# EAGLE design matts pcb schematic v3 (EAGLE 9.6.2)
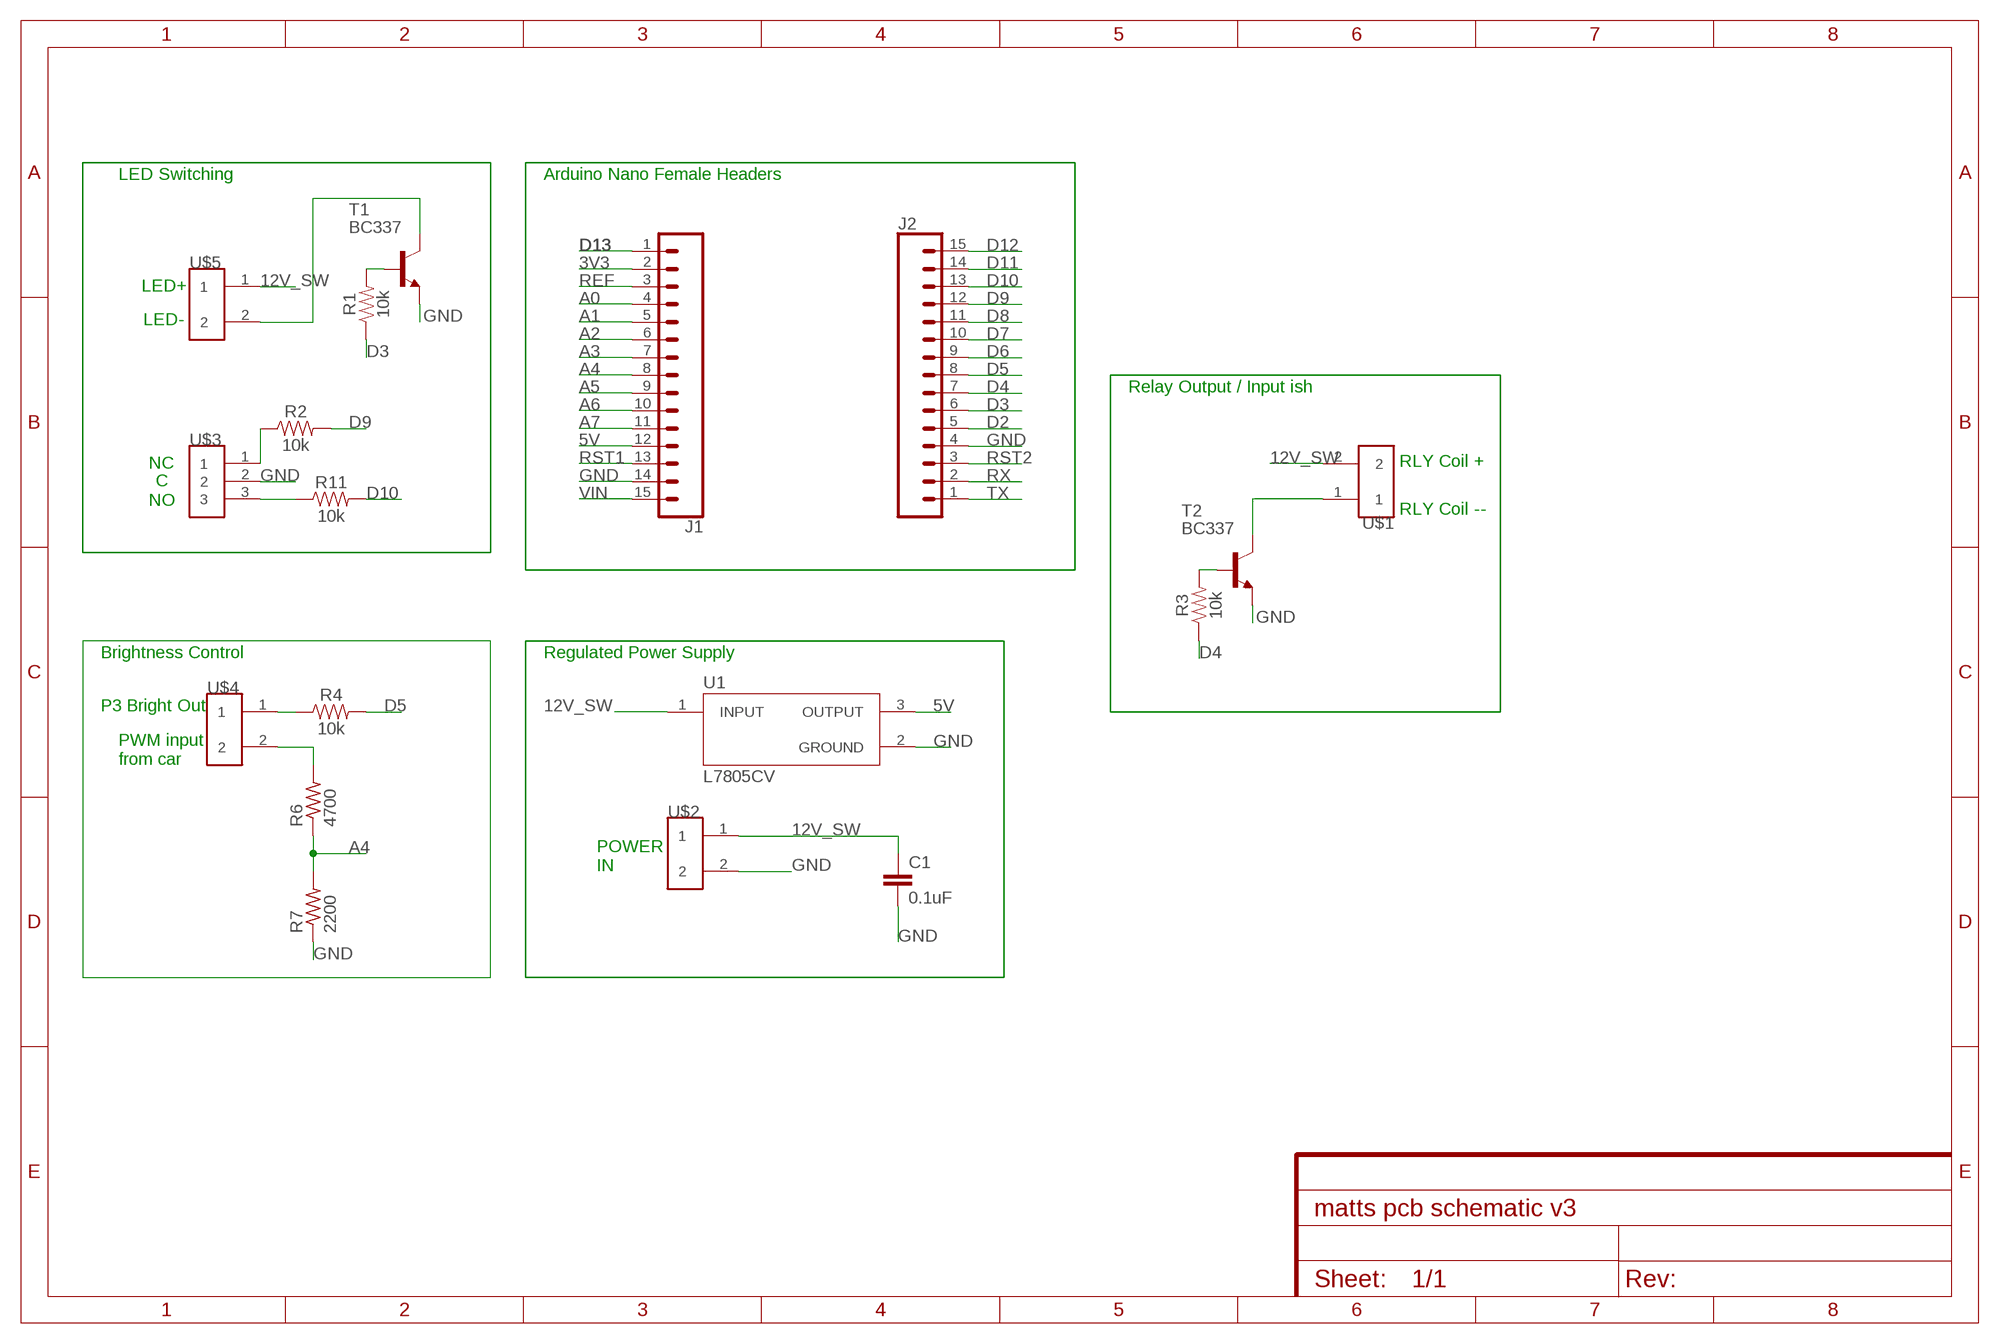
[diagram p0: schematic, sheet 1]

## Parts
C1  0.1uF  0.1UF-KIT-EZ-50V-20%  [CAP-PTH-SMALL-KIT]
J1  CONN_15  [1X15]
J2  CONN_15  [1X15]
R1  10k  100KOHM-HORIZ-1/4W-1%  [AXIAL-0.3]
R2  10k  100KOHM-HORIZ-1/4W-1%  [AXIAL-0.3]
R3  10k  100KOHM-HORIZ-1/4W-1%  [AXIAL-0.3]
R4  10k  100KOHM-HORIZ-1/4W-1%  [AXIAL-0.3]
R6  4700  R-US_0207/10  [0207/10]
R7  2200  R-US_0207/10  [0207/10]
R11  10k  100KOHM-HORIZ-1/4W-1%  [AXIAL-0.3]
T1  BC337  [TO92]
T2  BC337  [TO92]
U1  L7805CV  [TO255P1040X460X1968-3]
U$1  2PIN_0.2PITCH_SCREW_TERMINAL  [2PIN_0.2PITCH_SCREW_TERMINAL]
U$2  2PIN_0.2PITCH_SCREW_TERMINAL  [2PIN_0.2PITCH_SCREW_TERMINAL]
U$3  3PIN_0.2PITCH_SCREW_TERMINAL  [3PIN_0.2PITCH_SCREW_TERMINAL]
U$4  2PIN_0.2PITCH_SCREW_TERMINAL  [2PIN_0.2PITCH_SCREW_TERMINAL]
U$5  2PIN_0.2PITCH_SCREW_TERMINAL  [2PIN_0.2PITCH_SCREW_TERMINAL]

## Nets
3V3: J1.2
5V: J1.12 U1.3(OUTPUT)
12V_SW: C1.1 U1.1(INPUT) U$1.2 U$2.1 U$5.1
A0: J1.4
A1: J1.5
A2: J1.6
A3: J1.7
A4: J1.8 R6.1 R7.2
A5: J1.9
A6: J1.10
A7: J1.11
D2: J2.5
D3: J2.6 R1.P$1
D4: J2.7 R3.P$1
D5: J2.8 R4.P$2
D6: J2.9
D7: J2.10
D8: J2.11
D9: J2.12 R2.P$2
D10: J2.13 R11.P$2
D11: J2.14
D12: J2.15
D13: J1.1
GND: C1.2 J1.14 J2.4 R7.1 T1.1(E) T2.1(E) U1.2(GROUND) U$2.2 U$3.2
N$1: R2.P$1 U$3.1
N$2: T2.3(C) U$1.1
N$3: R4.P$1 U$4.1
N$4: T1.3(C) U$5.2
N$5: R3.P$2 T2.2(B)
N$6: R1.P$2 T1.2(B)
N$8: R6.2 U$4.2
N$10: R11.P$1 U$3.3
REF: J1.3
RST1: J1.13
RST2: J2.3
RX: J2.2
TX: J2.1
VIN: J1.15

## Notes on the sheet
- LED Switching | Arduino Nano Female Headers
- LED+
- LED-
- Relay Output / Input ish
- NC | RLY Coil +
- C
- NO
- RLY Coil --
- Brightness Control | Regulated Power Supply
- P3 Bright Out
- PWM input
  from car
- POWER 
  IN

## Library data of the parts
C1 = SparkFun-Capacitors:0.1UF: 0.1µF ceramic capacitors A capacitor is a passive two-terminal electrical component used to store electrical energy temporarily in an electric field.; PROD_ID: CAP-08370
J1 J2 = SparkFun-Connectors:CONN_15: Multi connection point. Often used as Generic Header-pin footprint for 0.1 inch spaced/style header connections On any of the 0.1 inch spaced packages, you can populate with these: Break Away Headers - Straight <https://www.sparkfun.com/products/116> (PRT-00116) Break Away Male Headers - Right Angle <https://www.sparkfun.com/products/553> (PRT-00553) Female Headers <https://www.sparkfun.com/products/115> (PRT-00115) Break Away Headers - Machine Pin <https://www.sparkfun.com/products/117> (PRT-00117) Break Away Female Headers - Swiss Machine Pin <https://www.sparkfun.com/products/743> (PRT-00743) For SCREWTERMINALS and SPRING TERMINALS visit here: Screw Terimnals on SparkFun.com <https://www.sparkfun.com/search/results?term=Screw+Terminals> (5mm/3.5mm/2.54mm spacing) This device is also useful as a general connection point to wire up your design to another part of your project. Our various solder wires solder well into these plated through hole pads. Hook-Up Wire - Assortment (Stranded, 22 AWG) <https://www.sparkfun.com/products/11375> (PRT-11375) Hook-Up Wire - Assortment (Solid Core, 22 AWG) <https://www.sparkfun.com/products/11367> (PRT-11367) View the entire wire category on our website here <https://www.sparkfun.com/categories/141> Special notes: Molex polarized connector foot print use with SKU : PRT-08231 with associated crimp pins and housings. 1MM SMD Version SKU: PRT-10208 NOTES ON THE VARIANTS LOCK and LOCK_LONGPADS... This footprint was designed to help hold the alignment of a through-hole component (i.e. 6-pin header) while soldering it into place. You may notice that each hole has been shifted either up or down by 0.005 of an inch from it's more standard position (which is a perfectly straight line). This slight alteration caused the pins (the squares in the middle) to touch the edges of the holes. Because they are alternating, it causes a "brace" to hold the component in place. 0.005 has proven to be the perfect amount of "off-center" position when using our standard breakaway headers. Although looks a little odd when you look at the bare footprint, once you have a header in there, the alteration is very hard to notice. Also,if you push a header all the way into place, it is covered up entirely on the bottom side.
R1-R4 R11 = SparkFun-Resistors:100KOHM: 100kΩ resistor A resistor is a passive two-terminal electrical component that implements electrical resistance as a circuit element. Resistors act to reduce current flow, and, at the same time, act to lower voltage levels within circuits. - Wikipedia; PROD_ID: RES-12184; VALUE: 100k
R6 R7 = rcl:R-US_: RESISTOR, American symbol; SPICEPREFIX: R
T1 T2 = transistor:BC337: NPN TRANSISTOR
U1 = L7805CV:L7805CV: Standard Regulator Pos 5V 1.5A 3-Pin(3+Tab) TO-220 Standard Regulator Pos 5V 1.5A 3-Pin(3+Tab) TO-220; AVAILABILITY: Unavailable; DESCRIPTION: Linear Voltage Regulator IC 1 Output 1.5A TO-220; MF: STMicroelectronics; MP: L7805CV; PACKAGE: TO-220 STMicroelectronics; PRICE: None
U$1 U$2 U$4 U$5 = SparkFun-Connectors:2PIN_0.2PITCH_SCREW_TERMINAL
U$3 = SparkFun-Connectors:3PIN_0.2PITCH_SCREW_TERMINAL

## Board
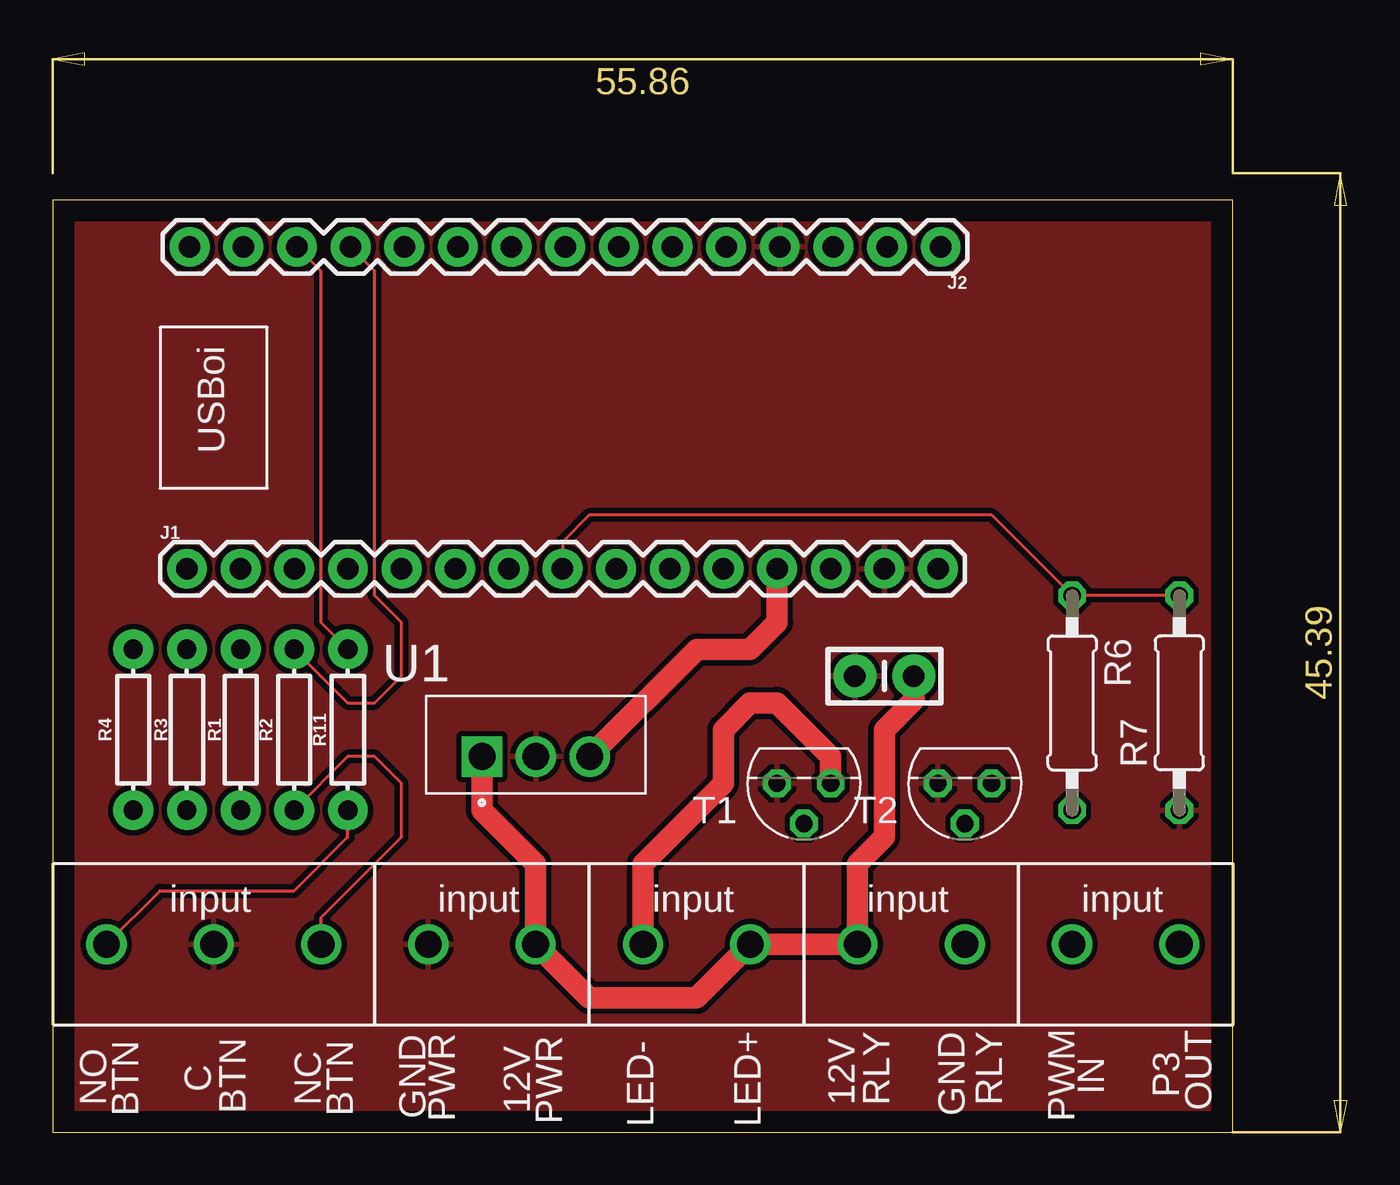
[diagram p1: board, top side]
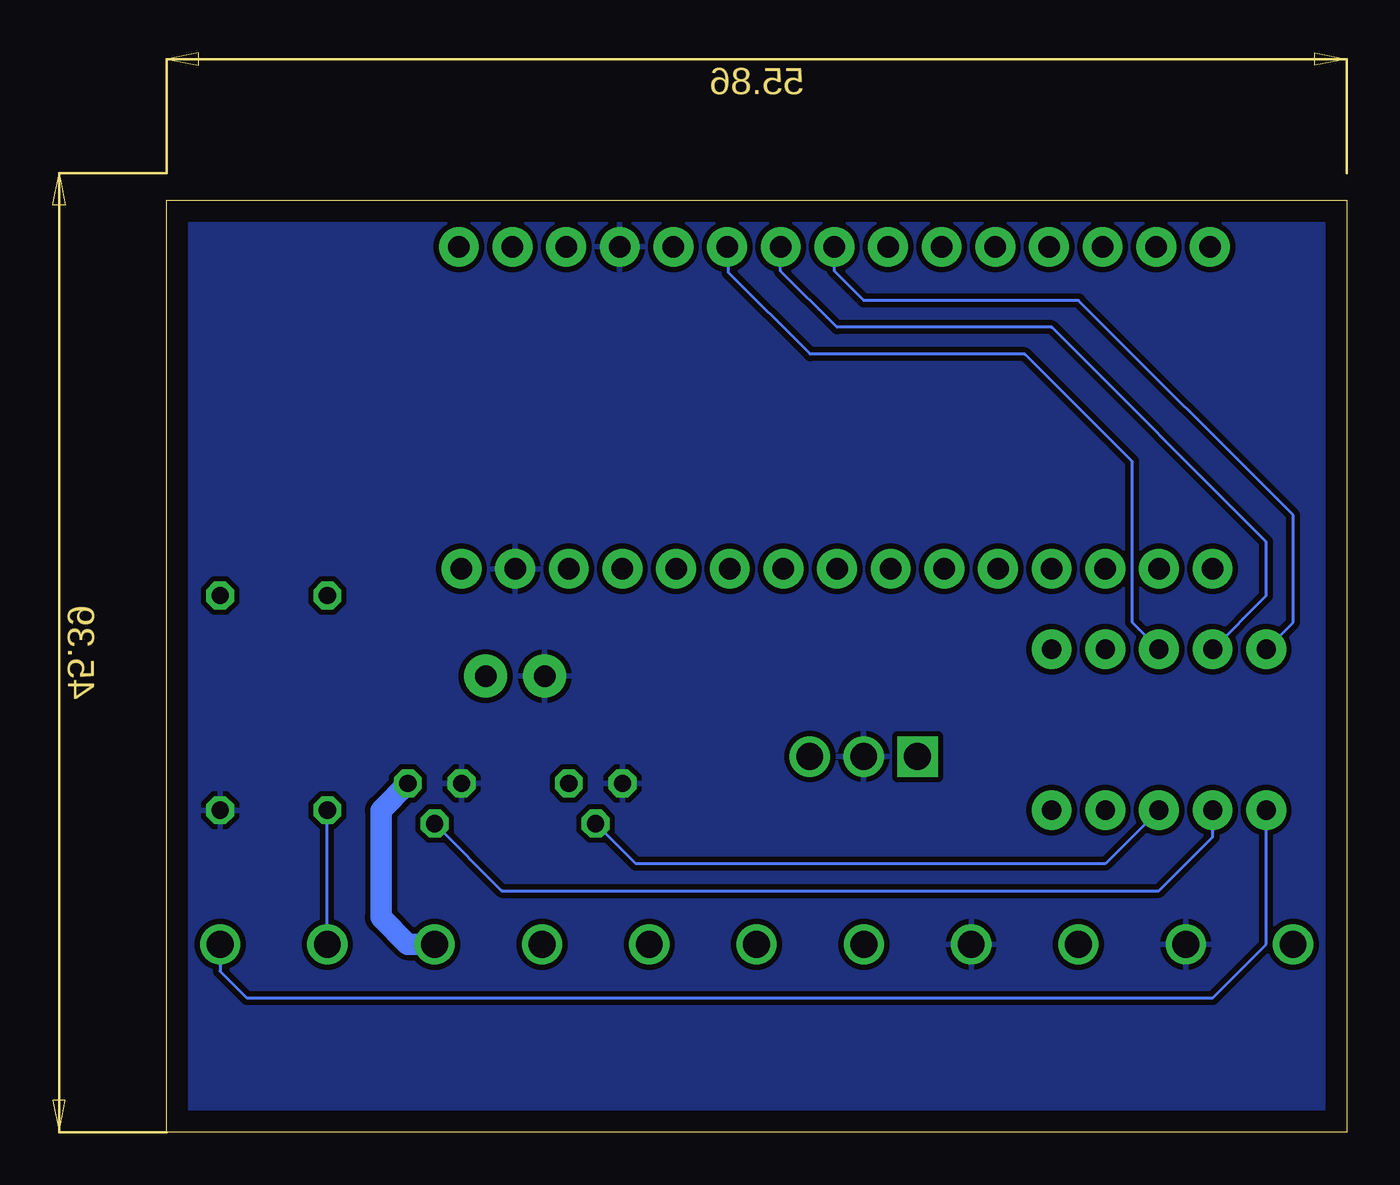
[diagram p2: board, bottom side, seen from below]

Size 55.86 x 44.12 mm. Coordinates in mm from the lower left corner, seen from the top.
Outline: 0,0 55.86,0 55.86,44.12 0,44.12 0,0
Copper layers (1*16): Top 0.035mm / dielectric 1.5mm / Bottom 0.035mm
Design rules "default": minimum track width 6mil, minimum drill 0.35mm, track to track 6mil, track to pad 6mil, pad to pad 6mil, via to via 6mil, smd to smd 6mil, copper to edge 40mil, drill to drill 6mil, minimum pad ring 10mil, minimum via ring 8mil, stop-mask expansion 4mil, vias tented up to drill 0mil, thermal gap 10mil

### Footprints (pad centres in the part's own frame; a part is rotated, then mirrored left to right if it is on the bottom)
CAP-PTH-SMALL-KIT = drill 1.016 pad 2.032: 1 -1.397,0; 2 1.397,0
1X15 = drill 1.016 pad 1.88: 1 0,0; 2 2.54,0; 3 5.08,0; 4 7.62,0; 5 10.16,0; 6 12.7,0; 7 15.24,0; 8 17.78,0; 9 20.32,0; 10 22.86,0; 11 25.4,0; 12 27.94,0; 13 30.48,0; 14 33.02,0; 15 35.56,0
AXIAL-0.3 = drill 0.9 pad 1.88: P$1 -3.81,0; P$2 3.81,0
0207/10 = drill 0.813 octagon: 1 -5.08,0; 2 5.08,0
TO92 = drill 0.813 octagon: 1 1.27,0; 2 0,1.905; 3 -1.27,0
TO255P1040X460X1968-3 = drill 1.27 pad 1.91 square: 1 0,0 | drill 1.27 pad 1.91: 2 2.55,0; 3 5.1,0
2PIN_0.2PITCH_SCREW_TERMINAL = drill 1.27: 1 -2.54,0; 2 2.54,0
3PIN_0.2PITCH_SCREW_TERMINAL = drill 1.27: 1 -5.08,0; 2 0,0; 3 5.08,0

### Placement (x,y rotation side)
C1  39.37,21.59 180 top
J1  6.35,26.67 0 top
J2  42.04,41.91 180 top
R1  8.89,19.05 270 top
R2  11.43,19.05 90 top
R3  6.35,19.05 270 top
R4  3.81,19.05 90 top
R6  48.26,20.32 270 top
R7  53.34,20.32 90 top
R11  13.97,19.05 90 top
T1  35.56,16.51 180 top
T2  43.18,16.51 180 top
U1  20.32,17.78 0 top
U$1  40.64,8.89 180 top
U$2  20.32,8.89 180 top
U$3  7.62,8.89 180 top
U$4  50.8,8.89 180 top
U$5  30.48,8.89 180 top

### Tracks (layer width: path | path; a pad name or v marks a point on that pad's centre or on a via)
5V
  Top 1.016: U1.3 30.5,22.86 33.02,22.86 34.29,24.13 J1.12
12V_SW
  Top 1.016: C1.1 40.77,20.45 39.37,19.05 39.37,13.97 38.1,12.7 U$1.2 U$5.1 30.48,6.35 25.4,6.35 U$2.1 22.86,12.7 20.32,15.24 U1.1
A4
  Top 0.152: R7.2 R6.1 44.45,29.21 25.4,29.21 24.13,27.94 J1.8
D3
  Bottom 0.152: J2.6 29.26,41.86 29.26,40.69 25.4,36.83 15.24,36.83 10.16,31.75 10.16,24.13 R1.P$1
D4
  Bottom 0.152: R3.P$1 3.81,25.4 3.81,27.94 13.97,38.1 24.13,38.1 26.8,40.77 J2.7
D5
  Bottom 0.152: R4.P$2 2.54,24.13 2.54,29.21 12.7,39.37 22.86,39.37 24.26,40.77 J2.8
D9
  Top 0.152: R2.P$2 13.97,20.32 15.24,20.32 16.51,21.59 16.51,24.13 15.24,25.4 15.24,40.77 J2.12
D10
  Top 0.152: R11.P$2 12.7,24.13 12.7,40.77 J2.13
GND
  pour Top (isolate 0.254): -2.54,44.45 -2.54,-2.54 58.42,-2.54 58.42,46.99 -2.54,46.99
  pour Bottom (isolate 0.254): -5.08,48.26 -5.08,-5.08 60.96,-5.08 60.96,49.53 -5.08,49.53
N$1
  Top 0.152: U$3.1 12.7,10.16 16.51,13.97 16.51,16.51 15.24,17.78 13.97,17.78 R2.P$1
N$2
  Bottom 1.016: T2.3 45.72,15.24 45.72,10.16 44.45,8.89 U$1.1
N$3
  Bottom 0.152: U$4.1 53.34,7.62 52.07,6.35 6.35,6.35 3.81,8.89 R4.P$1
N$4
  Top 1.016: U$5.2 27.94,12.7 31.75,16.51 31.75,19.05 33.02,20.32 34.29,20.32 36.83,17.78 T1.3
N$5
  Bottom 0.152: T2.2 40.01,11.43 8.89,11.43 6.35,13.97 R3.P$2
N$6
  Bottom 0.152: R1.P$2 11.43,12.7 33.66,12.7 T1.2
N$8
  Bottom 0.152: U$4.2 R6.2
N$10
  Top 0.152: U$3.3 5.08,11.43 11.43,11.43 13.97,13.97 R11.P$1

### Text on the board
tPlace: USBoi | C | IN | P3 | NO | BTN | BTN | NC | BTN | GND | PWR | 12V | 12V | RLY | GND | RLY | PWM | OUT | PWR | LED- | LED+